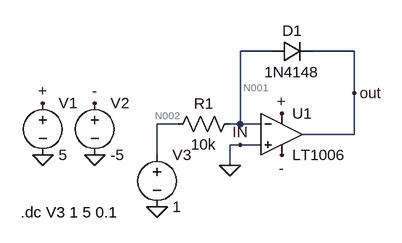
[diagram p0: schematic Draft1.asc]
Draft1.asc, the LTspice schematic file:
Version 4
SHEET 1 880 680
WIRE 288 48 240 48
WIRE 416 48 352 48
WIRE 416 112 416 48
WIRE 144 160 112 160
WIRE 240 160 240 48
WIRE 240 160 224 160
WIRE 272 160 240 160
WIRE 416 176 416 112
WIRE 416 176 336 176
WIRE 240 192 224 192
WIRE 272 192 240 192
WIRE 112 208 112 160
WIRE 224 224 224 192
FLAG -64 208 0
FLAG 16 208 0
FLAG 112 288 0
FLAG -64 128 +
FLAG 304 144 +
FLAG 16 128 -
FLAG 304 208 -
FLAG 416 112 out
FLAG 240 192 IN
FLAG 224 224 0
SYMBOL Opamps\\LT1006 304 112 R0
SYMATTR InstName U1
SYMBOL voltage -64 112 R0
WINDOW 123 0 0 Left 0
WINDOW 39 0 0 Left 0
SYMATTR InstName V1
SYMATTR Value 5
SYMBOL voltage 16 112 R0
WINDOW 123 0 0 Left 0
WINDOW 39 0 0 Left 0
SYMATTR InstName V2
SYMATTR Value -5
SYMBOL voltage 112 192 R0
WINDOW 123 0 0 Left 0
WINDOW 39 0 0 Left 0
SYMATTR InstName V3
SYMATTR Value 1
SYMBOL res 240 144 R90
WINDOW 0 0 56 VBottom 2
WINDOW 3 32 56 VTop 2
SYMATTR InstName R1
SYMATTR Value 10k
SYMBOL diode 288 64 R270
WINDOW 0 32 32 VTop 2
WINDOW 3 0 32 VBottom 2
SYMATTR InstName D1
SYMATTR Value 1N4148
TEXT -98 296 Left 2 !.dc V3 1 5 0.1

The netlist it stands for:
* Draft1.asc
XU1 0 N001 + - out LT1006  ; pins In+ In- V+ V- OUT
V1 + 0 5
V2 - 0 -5
V3 N002 0 1
R1 N001 N002 10k
D1 N001 out 1N4148
.model D D
.lib standard.dio
.dc V3 1 5 0.1
.lib LTC.lib
.backanno
.end

* Results of the author's LTspice run, read from the files saved beside the schematic
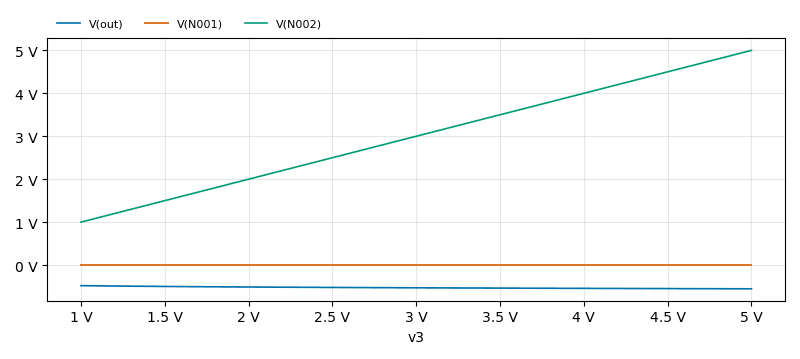
[diagram p1: DC transfer characteristic of Draft1.asc, plotted from the saved traces]
* DC transfer characteristic, 1 run:
*   V(out): -479.9 mV at v3=1 V, -553 mV at v3=5 V, min -553 mV, max -479.9 mV
*   V(N001): 143 nV at v3=1 V, 174.2 nV at v3=5 V, min 143 nV, max 174.2 nV
*   V(N002): 1 V at v3=1 V, 5 V at v3=5 V, min 1 V, max 5 V